# Altium schematic sheet FAR_SMALL.SchDoc
size A3
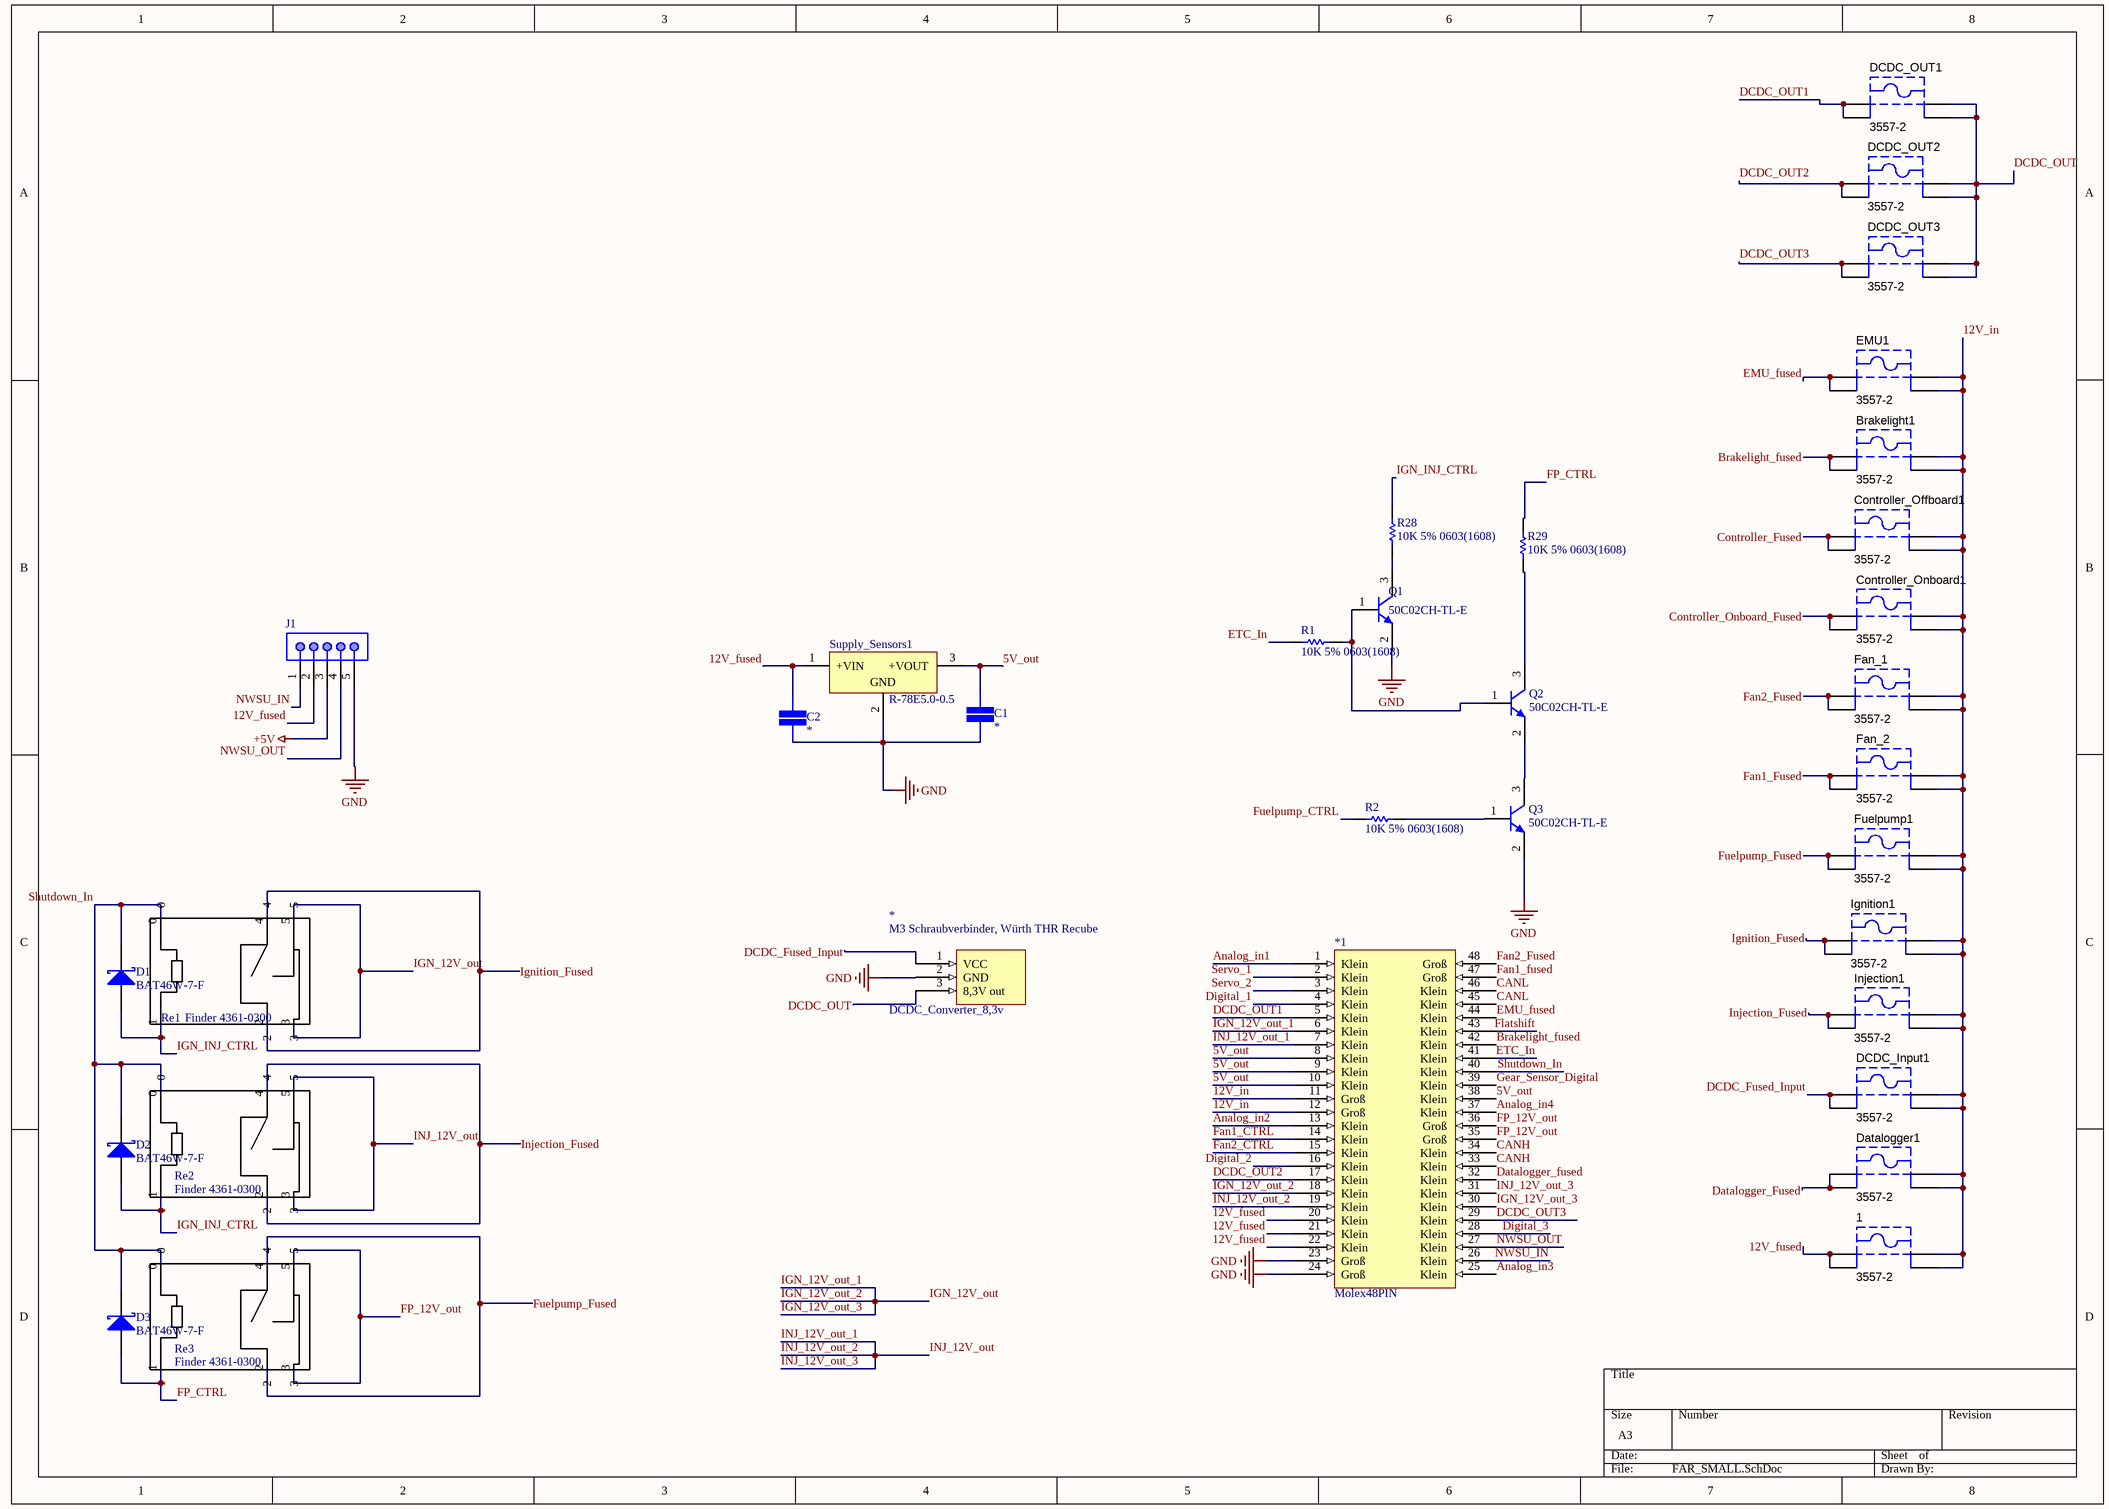
[diagram p0: FAR_SMALL.SchDoc]

## Parts
1  3557-2  [KSTN-3557-2]
*  DCDC_Converter_8,3v  [DCDC_BR_8,3V]
*1  Molex48PIN  [PCBComponent_1]
Brakelight1  3557-2  [KSTN-3557-2]
C1  SMD Capacitor  [CAP 0603/1608]  (value not drawn)
C2  SMD Capacitor  [CAP 0603/1608]  (value not drawn)
Controller_Offboard1  3557-2  [KSTN-3557-2]
Controller_Onboard1  3557-2  [KSTN-3557-2]
D1  BAT46W-7-F  [DIOD-SOD-123-2_V]
D2  BAT46W-7-F  [DIOD-SOD-123-2_V]
D3  BAT46W-7-F  [DIOD-SOD-123-2_V]
Datalogger1  3557-2  [KSTN-3557-2]
DCDC_Input1  3557-2  [KSTN-3557-2]
DCDC_OUT1  3557-2  [KSTN-3557-2]
DCDC_OUT2  3557-2  [KSTN-3557-2]
DCDC_OUT3  3557-2  [KSTN-3557-2]
EMU1  3557-2  [KSTN-3557-2]
Fan_1  3557-2  [KSTN-3557-2]
Fan_2  3557-2  [KSTN-3557-2]
Fuelpump1  3557-2  [KSTN-3557-2]
Ignition1  3557-2  [KSTN-3557-2]
Injection1  3557-2  [KSTN-3557-2]
J1  61300511121  [61300511121]  (value not drawn)
Q1  50C02CH-TL-E  [ONSC-CPH-3_V]
Q2  50C02CH-TL-E  [ONSC-CPH-3_V]
Q3  50C02CH-TL-E  [ONSC-CPH-3_V]
R1  10K 5% 0603(1608)  [RESC0603(1608)_N]
R2  10K 5% 0603(1608)  [RESC0603(1608)_N]
R28  10K 5% 0603(1608)  [RESC0603(1608)_N]
R29  10K 5% 0603(1608)  [RESC0603(1608)_N]
Re1  Finder 4361-0300  [Finder 436190120300]
Re2  Finder 4361-0300  [Finder 436190120300]
Re3  Finder 4361-0300  [Finder 436190120300]
Supply_Sensors1  R-78E5.0-0.5  [REPO-R-78E-0.5-3_V]

## Nets
+5V: J1.3
GND: *.2(GND) *1.23(Groß) *1.24(Groß) C1.1 C2.1 J1.5 Q1.2(E) Q3.2(E) Supply_Sensors1.2(GND)
5V_out: *1.8(Klein) *1.9(Klein) *1.10(Klein) *1.38(Klein) C1.2 Supply_Sensors1.3(+VOUT)
12V_fused: 1.1 1.2 *1.20(Klein) *1.21(Klein) *1.22(Klein) C2.2 J1.2 Supply_Sensors1.1(+VIN)
12V_in: 1.3 1.4 *1.11(Groß) *1.12(Groß) Brakelight1.3 Brakelight1.4 Controller_Offboard1.3 Controller_Offboard1.4 Controller_Onboard1.3 Controller_Onboard1.4 Datalogger1.3 Datalogger1.4 DCDC_Input1.3 DCDC_Input1.4 EMU1.3 EMU1.4 Fan_1.3 Fan_1.4 Fan_2.3 Fan_2.4 Fuelpump1.3 Fuelpump1.4 Ignition1.3 Ignition1.4 Injection1.3 Injection1.4
Analog_in1: *1.1(Klein)
Analog_in2: *1.13(Klein)
Analog_in3: *1.25(Klein)
Analog_in4: *1.37(Klein)
Brakelight_fused: *1.42(Klein) Brakelight1.1 Brakelight1.2
CANH: *1.33(Klein) *1.34(Klein)
CANL: *1.45(Klein) *1.46(Klein)
Controller_Fused: Controller_Offboard1.1 Controller_Offboard1.2
Controller_Onboard_Fused: Controller_Onboard1.1 Controller_Onboard1.2
Datalogger_Fused: *1.32(Klein) Datalogger1.1 Datalogger1.2
DCDC_Fused_Input: *.1(VCC) DCDC_Input1.1 DCDC_Input1.2
DCDC_OUT: *.3(8,3V_out) DCDC_OUT1.3 DCDC_OUT1.4 DCDC_OUT2.3 DCDC_OUT2.4 DCDC_OUT3.3 DCDC_OUT3.4
DCDC_OUT1: *1.5(Klein) DCDC_OUT1.1 DCDC_OUT1.2
DCDC_OUT2: *1.17(Klein) DCDC_OUT2.1 DCDC_OUT2.2
DCDC_OUT3: *1.29(Klein) DCDC_OUT3.1 DCDC_OUT3.2
Digital_1: *1.4(Klein)
Digital_2: *1.16(Klein)
Digital_3: *1.28(Klein)
EMU_fused: *1.44(Klein) EMU1.1 EMU1.2
ETC_In: *1.41(Klein) R1.1
Fan1_CTRL: *1.14(Klein)
Fan1_Fused: *1.47(Groß) Fan_2.1 Fan_2.2
Fan2_CTRL: *1.15(Klein)
Fan2_Fused: *1.48(Groß) Fan_1.1 Fan_1.2
Flatshift: *1.43(Klein)
FP_12V_out: *1.35(Groß) *1.36(Groß) Re3.3 Re3.5
FP_CTRL: D3.1(A) R29.2 Re3.1
Fuelpump_CTRL: R2.1
Fuelpump_Fused: Fuelpump1.1 Fuelpump1.2 Re3.2 Re3.4
Gear_Sensor_Digital: *1.39(Klein)
IGN_12V_out: *1.6(Klein) *1.18(Klein) *1.30(Klein) Re1.3 Re1.5  [also labelled IGN_12V_out_1, IGN_12V_out_2, IGN_12V_out_3]
IGN_INJ_CTRL: D1.1(A) D2.1(A) R28.2 Re1.1 Re2.1
Ignition_Fused: Ignition1.1 Ignition1.2 Re1.2 Re1.4
INJ_12V_out: *1.7(Klein) *1.19(Klein) *1.31(Klein) Re2.3 Re2.5  [also labelled INJ_12V_out_1, INJ_12V_out_2, INJ_12V_out_3]
Injection_Fused: Injection1.1 Injection1.2 Re2.2 Re2.4
NWSU_IN: *1.26(Klein) J1.1
NWSU_OUT: *1.27(Klein) J1.4
Servo_1: *1.2(Klein)
Servo_2: *1.3(Klein)
Shutdown_In: *1.40(Klein) D1.2(K) D2.2(K) D3.2(K) Re1.0 Re2.0 Re3.0
NetQ1_1: Q1.1(B) Q2.1(B) R1.2
NetQ1_3: Q1.3(C) R28.1
NetQ2_2: Q2.2(E) Q3.3(C)
NetQ2_3: Q2.3(C) R29.1
NetQ3_1: Q3.1(B) R2.2

## Notes on the sheet
- (in symbol DCDC_Converter_8,3v) M3 Schraubverbinder, Würth THR Recube

## Library data of the parts
1 Brakelight1 Controller_Offboard1 Controller_Onboard1 Datalogger1 DCDC_Input1 DCDC_OUT1-DCDC_OUT3 EMU1 Fan_1 Fan_2 Fuelpump1 Ignition1 Injection1 = CMP-2000-05461-1: FUSE HOLDER, PCB MOUNT, 500VAC, 20A, ROHS; Manufacturer: Keystone-Electronics; Number of Circuits: 1; Voltage: 500V; Fuseholder Type: Block; Fuse Type: Blade; Fuse Size: 0.43"Lx0.15"Wx0.64"H(10.92mmx3.81mmx16.25mm); For Use With/Related Products: ATC,ATO257,MINI897; Current Rating: 30A; Datasheet URL: http://datasheet.octopart.com/3557-2-Keystone-datasheet-15715937.pdf; Orientation: Vertical; Family: Fuseholders; Datasheet Version: Apr-13; Contact Finish: TinNickel; Mounting Type: PCB; Series: -; Category: CircuitProtection; Termination Style: PCPin; Contact Material: Brass; Manufacturer URL: http://www.keyelco.com/
C1 C2 = SMD Capacitor: Capacitor with multiple Footprints; Value: *
D1-D3 = CMP-0303-00004-1: Surface Mount Schottky Barrier Diode, 100 V, -55 to 125 degC, 2-Pin SOD123, RoHS, Tape and Reel; Manufacturer: Diodes Inc; IR@1.5 V: 0.3 uA Max.; V(BR)R: 100 V Min.; VF@10 mA: 0.45 V Max.; CT@1 V: 12 pF Typ.; PartNumber: BAT46W-7-F; ComponentLink1URL: http://www.diodes.com/; ComponentLink3URL: http://diodes.com/datasheets/ds30044.pdf; PackageDescription: 2-Pin SMD, Body 2.7 x 1.55 mm, Height 1.45 mm; ComponentLink2Description: Datasheet; ComponentLink3Description: Package Specification; Mounting Technology: Surface Mount; ComponentLink1Description: Manufacturer URL; RoHS: TRUE; Operating Temperature: -55 to 125 degC; Packing: Tape and Reel; ComponentLink2URL: http://diodes.com/datasheets/ds30044.pdf; DatasheetVersion: Rev. 16-2
J1 = 61300511121: WR-PHD Pin Header, THT, pitch 2.54mm, Single Row, Vertical, 5pin; Pin Number: 5; Gender: Male; Rated Current: 3A; Working Voltage: 250VAC; Withstanding Voltage: 500VAC; Contact Resistance: 20mOhm; ComponentLink1Description: Manufacturer; ComponentLink1URL: http://www.we-online.de; ComponentLink2Description: Datasheet; ComponentLink2URL: https://katalog.we-online.de/em/datasheet/6130xx11121.pdf; Part Number: 61300511121; Published Date: June 2019; Publisher: Wurth Elektronik; Pitch: 2.54mm; Operating Temperature: -40 to +105degC; Mounting Technology: THT; Packaging: Bag; Row Number: Single; Orientation: Vertical
Q1-Q3 = CMP-1048-00075-1: Bipolar Transistor, 50 V, 0.5 A, Low VCE(sat), NPN Single, 3-Pin CPH, Pb-Free, Tape and Reel; Manufacturer: On Semiconductor; IC Continuous (A): 0.5; Polarity: NPN; ComponentLink2Description: Datasheet; ComponentLink1URL: http://www.onsemi.com/; PartNumber: 50C02CH-TL-E; ComponentLink1Description: Manufacturer URL; PackageReference: CPH-3; Mounting Technology: Surface Mount; ComponentLink2URL: http://www.onsemi.com/pub_link/Collateral/50C02CH-D.PDF; PackageDescription: 3-Pin Small Outline Transistor, Body 2.9 x 1.6 mm, Pitch 0.95 mm; ComponentLink3Description: Package Specification; ComponentLink3URL: http://www.onsemi.com/pub_link/Collateral/50A02CH-D.PDF; Packing: Tape and Reel; RoHS: TRUE
R1 R2 R28 R29 = CMP-1012-00098-1: 10K 0.1W 5% 0603 (1608 Metric)  SMD; Case-EIA: 0603; Value: 10000.00 Ohm; Case-Metric: 1608; Technology: SMT; Tolerance: 5 %; Power: 0.1 W
Re1-Re3 = Finder 4361-0300: 1 Schließer, 16A; pin to pad: 0>1 1>2 2>3 3>4 4>5 5>6
Supply_Sensors1 = CMP-2000-06922-2: DC/DC-Converter, 5 V Single Output, 500 mA, -40 to 85 degC, 3-Pin THD, RoHS, Tube; Manufacturer: Recom Power; Efficiency: 92%; Number of Outputs: 1; Current - Output (Max): 500mA; VIN Min: 7V; Package Version: Rev. 0; VIN Max: 28V; VOUT: 5V; Manufacturer URL: http://www.recom-power.com/us/americas/home.html; Operating Temperature: -40°C~85°C; Datasheet Version: 01/2017; Packaging: Tube; Package Reference: SIP Module; Datasheet URL: http://www.recom-power.com/pdf/Innoline/R-78Exx-0.5.pdf; Package Description: 3-Pin Through Hole Device, Body 11.6 x 8.5 mm, Pitch 2.54 mm; Mounting Technology: ThroughHole